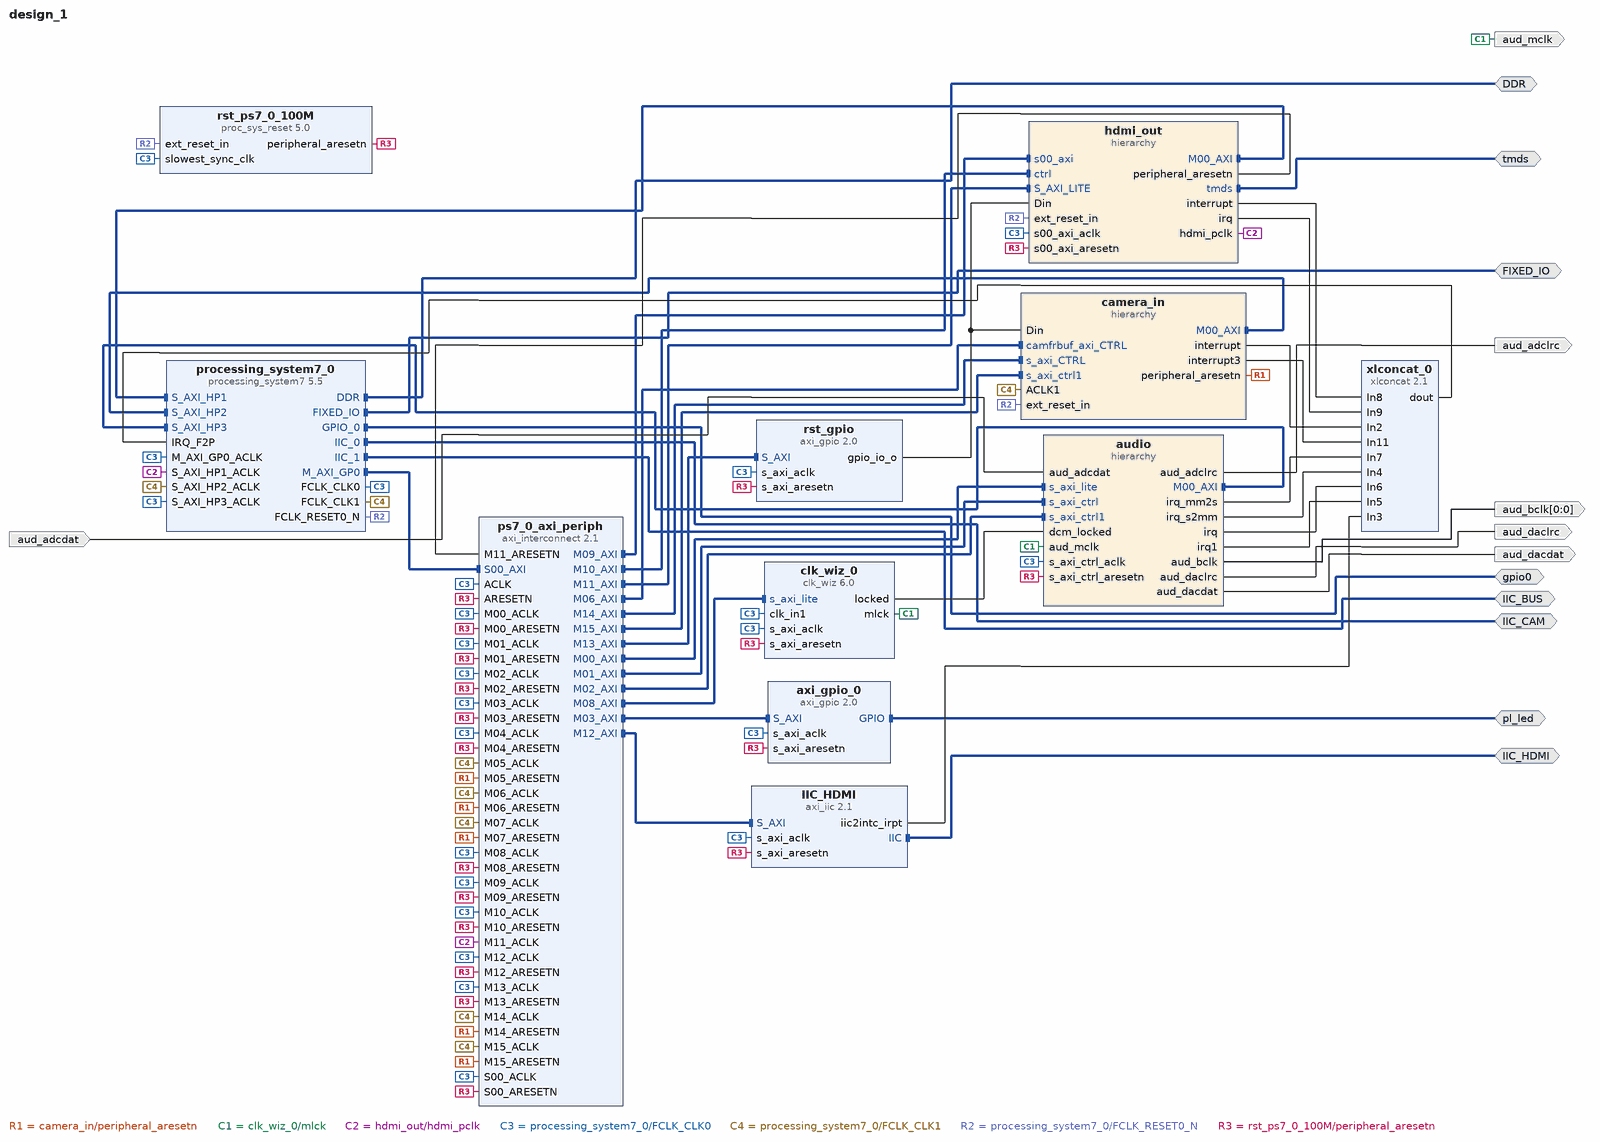
[diagram p0: block diagram of the top level]
# Vivado block design design_1, xc7z020clg400-2, Vivado 2023.1
create_bd_design design_1

create_bd_intf_port -mode Master -vlnv xilinx.com:interface:ddrx_rtl:1.0 DDR
create_bd_intf_port -mode Master -vlnv xilinx.com:display_processing_system7:fixedio_rtl:1.0 FIXED_IO
create_bd_intf_port -mode Master -vlnv xilinx.com:interface:gpio_rtl:1.0 gpio0
create_bd_intf_port -mode Master -vlnv xilinx.com:interface:iic_rtl:1.0 IIC_CAM
create_bd_intf_port -mode Master -vlnv xilinx.com:interface:iic_rtl:1.0 IIC_BUS
create_bd_intf_port -mode Master -vlnv xilinx.com:interface:iic_rtl:1.0 IIC_HDMI
create_bd_intf_port -mode Master -vlnv xilinx.com:interface:gpio_rtl:1.0 pl_led
create_bd_intf_port -mode Master -vlnv openedv.com:user:TMDS_rtl:1.0 tmds
create_bd_port -dir I aud_adcdat
create_bd_port -dir O aud_adclrc
create_bd_port -dir O -from 0 -to 0 aud_bclk
create_bd_port -dir O aud_dacdat
create_bd_port -dir O aud_daclrc
create_bd_port -dir O -type clk aud_mclk

create_bd_cell -type hier audio
create_bd_cell -type hier hdmi_out
create_bd_cell -type hier camera_in
create_bd_cell -type ip -vlnv xilinx.com:ip:axi_iic:2.1 IIC_HDMI
create_bd_cell -type ip -vlnv xilinx.com:ip:axi_gpio:2.0 axi_gpio_0
set_property -dict {CONFIG.C_ALL_OUTPUTS 1 CONFIG.C_GPIO_WIDTH 3} [get_bd_cells axi_gpio_0]
create_bd_cell -type ip -vlnv xilinx.com:ip:clk_wiz:6.0 clk_wiz_0
set_property -dict [list \
  CONFIG.CLKOUT1_DRIVES BUFG \
  CONFIG.CLKOUT1_JITTER 272.870 \
  CONFIG.CLKOUT1_PHASE_ERROR 189.550 \
  CONFIG.CLKOUT1_REQUESTED_OUT_FREQ 16.9344 \
  CONFIG.CLKOUT1_USED true \
  CONFIG.CLKOUT2_DRIVES BUFG \
  CONFIG.CLKOUT2_JITTER 183.032 \
  CONFIG.CLKOUT2_PHASE_ERROR 94.994 \
  CONFIG.CLKOUT2_REQUESTED_OUT_FREQ 100.000 \
  CONFIG.CLKOUT2_USED false \
  CONFIG.CLKOUT3_DRIVES BUFG \
  CONFIG.CLKOUT3_JITTER 145.297 \
  CONFIG.CLKOUT3_PHASE_ERROR 167.636 \
  CONFIG.CLKOUT3_USED false \
  CONFIG.CLKOUT4_DRIVES BUFG \
  CONFIG.CLKOUT5_DRIVES BUFG \
  CONFIG.CLKOUT6_DRIVES BUFG \
  CONFIG.CLKOUT7_DRIVES BUFG \
  CONFIG.CLK_OUT1_PORT mlck \
  CONFIG.CLK_OUT2_PORT clk_out2 \
  CONFIG.MMCM_CLKFBOUT_MULT_F 31.625 \
  CONFIG.MMCM_CLKOUT0_DIVIDE_F 62.250 \
  CONFIG.MMCM_CLKOUT1_DIVIDE 1 \
  CONFIG.MMCM_CLKOUT2_DIVIDE 1 \
  CONFIG.MMCM_DIVCLK_DIVIDE 3 \
  CONFIG.NUM_OUT_CLKS 1 \
  CONFIG.SECONDARY_SOURCE Single_ended_clock_capable_pin \
  CONFIG.USE_DYN_RECONFIG true \
  CONFIG.USE_PHASE_ALIGNMENT false \
] [get_bd_cells clk_wiz_0]
create_bd_cell -type ip -vlnv xilinx.com:ip:processing_system7:5.5 processing_system7_0
set_property -dict [list \
  CONFIG.PCW_APU_PERIPHERAL_FREQMHZ 766.66666666666666666666 \
  CONFIG.PCW_CPU_CPU_6X4X_MAX_RANGE 767 \
  CONFIG.PCW_ENET0_ENET0_IO {MIO 16 .. 27} \
  CONFIG.PCW_ENET0_GRP_MDIO_ENABLE 1 \
  CONFIG.PCW_ENET0_GRP_MDIO_IO {MIO 52 .. 53} \
  CONFIG.PCW_ENET0_PERIPHERAL_ENABLE 1 \
  CONFIG.PCW_ENET0_RESET_ENABLE 1 \
  CONFIG.PCW_ENET0_RESET_IO {MIO 51} \
  CONFIG.PCW_ENET1_PERIPHERAL_CLKSRC External \
  CONFIG.PCW_ENET_RESET_ENABLE 1 \
  CONFIG.PCW_ENET_RESET_SELECT {Share reset pin} \
  CONFIG.PCW_EN_CLK1_PORT 1 \
  CONFIG.PCW_EN_CLK2_PORT 1 \
  CONFIG.PCW_FCLK1_PERIPHERAL_CLKSRC {DDR PLL} \
  CONFIG.PCW_FCLK3_PERIPHERAL_CLKSRC {ARM PLL} \
  CONFIG.PCW_FCLK_CLK1_BUF TRUE \
  CONFIG.PCW_FCLK_CLK2_BUF TRUE \
  CONFIG.PCW_FPGA0_PERIPHERAL_FREQMHZ 100.0 \
  CONFIG.PCW_FPGA1_PERIPHERAL_FREQMHZ 150 \
  CONFIG.PCW_FPGA2_PERIPHERAL_FREQMHZ 200 \
  CONFIG.PCW_FPGA3_PERIPHERAL_FREQMHZ 12 \
  CONFIG.PCW_FPGA_FCLK1_ENABLE 1 \
  CONFIG.PCW_FPGA_FCLK2_ENABLE 1 \
  CONFIG.PCW_GPIO_EMIO_GPIO_ENABLE 1 \
  CONFIG.PCW_GPIO_EMIO_GPIO_IO 10 \
  CONFIG.PCW_GPIO_EMIO_GPIO_WIDTH 10 \
  CONFIG.PCW_GPIO_MIO_GPIO_ENABLE 1 \
  CONFIG.PCW_GPIO_MIO_GPIO_IO MIO \
  CONFIG.PCW_I2C0_I2C0_IO EMIO \
  CONFIG.PCW_I2C0_PERIPHERAL_ENABLE 1 \
  CONFIG.PCW_I2C1_I2C1_IO EMIO \
  CONFIG.PCW_I2C1_PERIPHERAL_ENABLE 1 \
  CONFIG.PCW_I2C_PERIPHERAL_FREQMHZ 127.777779 \
  CONFIG.PCW_I2C_RESET_ENABLE 0 \
  CONFIG.PCW_IRQ_F2P_INTR 1 \
  CONFIG.PCW_PERIPHERAL_BOARD_PRESET None \
  CONFIG.PCW_PRESET_BANK1_VOLTAGE {HSTL 1.8V} \
  CONFIG.PCW_QSPI_GRP_SINGLE_SS_ENABLE 1 \
  CONFIG.PCW_QSPI_GRP_SINGLE_SS_IO {MIO 1 .. 6} \
  CONFIG.PCW_QSPI_PERIPHERAL_ENABLE 1 \
  CONFIG.PCW_QSPI_QSPI_IO {MIO 1 .. 6} \
  CONFIG.PCW_SD0_GRP_CD_ENABLE 0 \
  CONFIG.PCW_SD0_GRP_WP_ENABLE 0 \
  CONFIG.PCW_SD0_PERIPHERAL_ENABLE 1 \
  CONFIG.PCW_SD0_SD0_IO {MIO 40 .. 45} \
  CONFIG.PCW_SD1_PERIPHERAL_ENABLE 1 \
  CONFIG.PCW_SD1_SD1_IO {MIO 10 .. 15} \
  CONFIG.PCW_SDIO_PERIPHERAL_FREQMHZ 125 \
  CONFIG.PCW_SINGLE_QSPI_DATA_MODE x4 \
  CONFIG.PCW_UART1_PERIPHERAL_ENABLE 1 \
  CONFIG.PCW_UART1_UART1_IO {MIO 48 .. 49} \
  CONFIG.PCW_UART_PERIPHERAL_FREQMHZ 100 \
  CONFIG.PCW_UIPARAM_DDR_FREQ_MHZ 533.333333 \
  CONFIG.PCW_UIPARAM_DDR_MEMORY_TYPE {DDR 3 (Low Voltage)} \
  CONFIG.PCW_UIPARAM_DDR_PARTNO {MT41J256M16 RE-125} \
  CONFIG.PCW_USB0_PERIPHERAL_ENABLE 1 \
  CONFIG.PCW_USB0_RESET_ENABLE 1 \
  CONFIG.PCW_USB0_RESET_IO {MIO 46} \
  CONFIG.PCW_USB0_USB0_IO {MIO 28 .. 39} \
  CONFIG.PCW_USB_RESET_ENABLE 1 \
  CONFIG.PCW_USB_RESET_SELECT {Share reset pin} \
  CONFIG.PCW_USE_FABRIC_INTERRUPT 1 \
  CONFIG.PCW_USE_S_AXI_HP1 1 \
  CONFIG.PCW_USE_S_AXI_HP2 1 \
  CONFIG.PCW_USE_S_AXI_HP3 1 \
] [get_bd_cells processing_system7_0]
# 513 more settings of processing_system7_0 are not shown: defaults, MIO pin electricals, DDR timing, and values the tool derives
create_bd_cell -type ip -vlnv xilinx.com:ip:axi_interconnect:2.1 ps7_0_axi_periph
set_property -dict [list \
  CONFIG.M00_HAS_DATA_FIFO 0 \
  CONFIG.M01_HAS_DATA_FIFO 0 \
  CONFIG.M02_HAS_DATA_FIFO 0 \
  CONFIG.M03_HAS_DATA_FIFO 0 \
  CONFIG.NUM_MI 16 \
] [get_bd_cells ps7_0_axi_periph]
create_bd_cell -type ip -vlnv xilinx.com:ip:axi_gpio:2.0 rst_gpio
set_property -dict {CONFIG.C_ALL_OUTPUTS 1 CONFIG.C_GPIO_WIDTH 7} [get_bd_cells rst_gpio]
create_bd_cell -type ip -vlnv xilinx.com:ip:proc_sys_reset:5.0 rst_ps7_0_100M
create_bd_cell -type ip -vlnv xilinx.com:ip:xlconcat:2.1 xlconcat_0
set_property -dict {CONFIG.NUM_PORTS 13 CONFIG.dout_width 13} [get_bd_cells xlconcat_0]

# ---- hierarchy /audio ----
current_bd_instance /audio
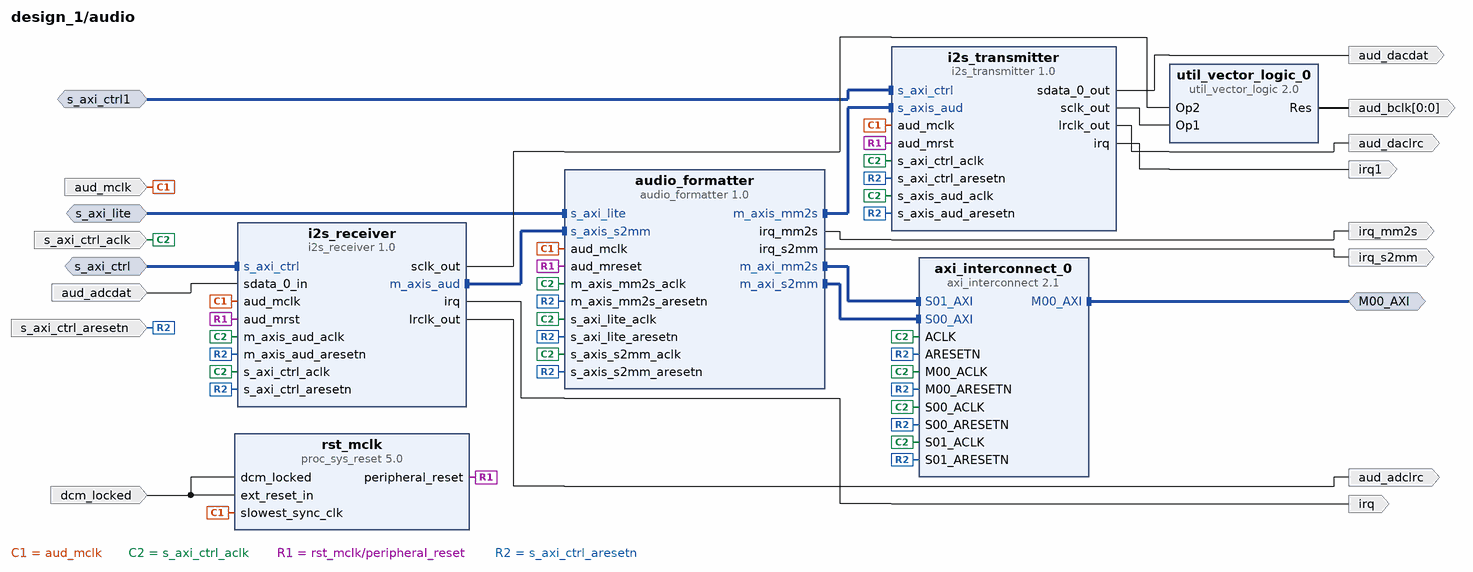
[diagram p1: block diagram inside /audio]
create_bd_intf_pin -mode Master -vlnv xilinx.com:interface:aximm_rtl:1.0 M00_AXI
create_bd_intf_pin -mode Slave -vlnv xilinx.com:interface:aximm_rtl:1.0 s_axi_ctrl
create_bd_intf_pin -mode Slave -vlnv xilinx.com:interface:aximm_rtl:1.0 s_axi_ctrl1
create_bd_intf_pin -mode Slave -vlnv xilinx.com:interface:aximm_rtl:1.0 s_axi_lite
create_bd_pin -dir I aud_adcdat
create_bd_pin -dir O aud_adclrc
create_bd_pin -dir O -from 0 -to 0 aud_bclk
create_bd_pin -dir O aud_dacdat
create_bd_pin -dir O aud_daclrc
create_bd_pin -dir I -type clk aud_mclk
create_bd_pin -dir I dcm_locked
create_bd_pin -dir O -type intr irq
create_bd_pin -dir O -type intr irq1
create_bd_pin -dir O -type intr irq_mm2s
create_bd_pin -dir O -type intr irq_s2mm
create_bd_pin -dir I -type clk s_axi_ctrl_aclk
create_bd_pin -dir I -type rst s_axi_ctrl_aresetn

create_bd_cell -type ip -vlnv xilinx.com:ip:audio_formatter:1.0 audio_formatter
set_property -dict [list \
  CONFIG.C_MM2S_ADDR_WIDTH 32 \
  CONFIG.C_MM2S_ASYNC_CLOCK 0 \
  CONFIG.C_S2MM_ADDR_WIDTH 32 \
  CONFIG.C_S2MM_ASYNC_CLOCK 0 \
] [get_bd_cells audio_formatter]
create_bd_cell -type ip -vlnv xilinx.com:ip:axi_interconnect:2.1 axi_interconnect_0
set_property -dict {CONFIG.NUM_MI 1 CONFIG.NUM_SI 2} [get_bd_cells axi_interconnect_0]
create_bd_cell -type ip -vlnv xilinx.com:ip:i2s_receiver:1.0 i2s_receiver
create_bd_cell -type ip -vlnv xilinx.com:ip:i2s_transmitter:1.0 i2s_transmitter
create_bd_cell -type ip -vlnv xilinx.com:ip:proc_sys_reset:5.0 rst_mclk
create_bd_cell -type ip -vlnv xilinx.com:ip:util_vector_logic:2.0 util_vector_logic_0
set_property -dict {CONFIG.C_OPERATION or CONFIG.C_SIZE 1} [get_bd_cells util_vector_logic_0]

# ---- hierarchy /hdmi_out ----
current_bd_instance /hdmi_out
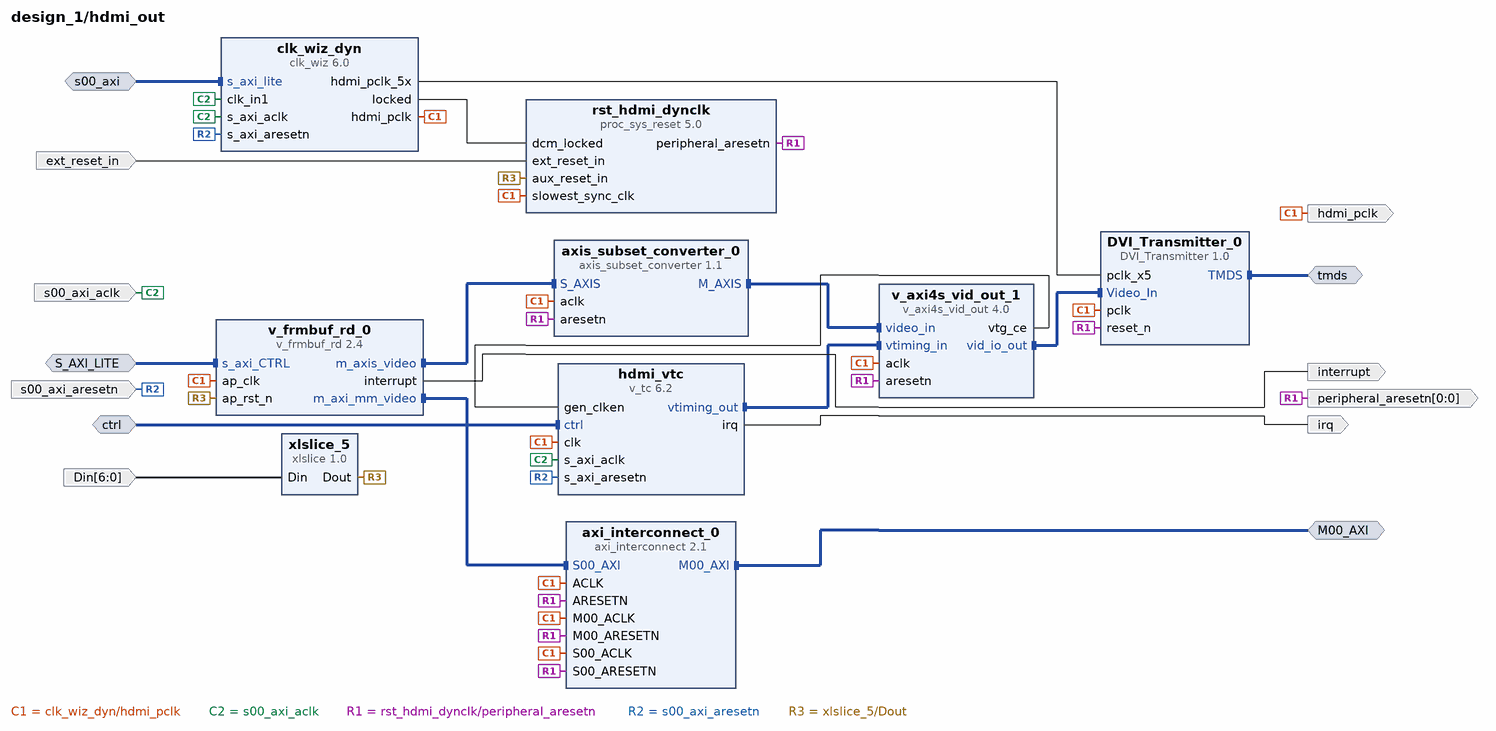
[diagram p2: block diagram inside /hdmi_out]
create_bd_intf_pin -mode Master -vlnv xilinx.com:interface:aximm_rtl:1.0 M00_AXI
create_bd_intf_pin -mode Slave -vlnv xilinx.com:interface:aximm_rtl:1.0 S_AXI_LITE
create_bd_intf_pin -mode Slave -vlnv xilinx.com:interface:aximm_rtl:1.0 ctrl
create_bd_intf_pin -mode Slave -vlnv xilinx.com:interface:aximm_rtl:1.0 s00_axi
create_bd_intf_pin -mode Master -vlnv openedv.com:user:TMDS_rtl:1.0 tmds
create_bd_pin -dir I -from 6 -to 0 Din
create_bd_pin -dir I -type rst ext_reset_in
create_bd_pin -dir O -type clk hdmi_pclk
create_bd_pin -dir O -type intr interrupt
create_bd_pin -dir O -type intr irq
create_bd_pin -dir O -from 0 -to 0 -type rst peripheral_aresetn
create_bd_pin -dir I -type clk s00_axi_aclk
create_bd_pin -dir I -type rst s00_axi_aresetn

create_bd_cell -type ip -vlnv openedv.com:user:DVI_Transmitter:1.0 DVI_Transmitter_0
create_bd_cell -type ip -vlnv xilinx.com:ip:axi_interconnect:2.1 axi_interconnect_0
set_property -dict [list \
  CONFIG.ENABLE_ADVANCED_OPTIONS 0 \
  CONFIG.NUM_MI 1 \
  CONFIG.S00_HAS_DATA_FIFO 2 \
  CONFIG.S00_HAS_REGSLICE 4 \
] [get_bd_cells axi_interconnect_0]
create_bd_cell -type ip -vlnv xilinx.com:ip:axis_subset_converter:1.1 axis_subset_converter_0
set_property -dict [list \
  CONFIG.M_TDATA_NUM_BYTES 3 \
  CONFIG.S_TDATA_NUM_BYTES 3 \
  CONFIG.TDATA_REMAP {tdata[15:8],tdata[7:0],tdata[23:16]} \
  CONFIG.TDEST_REMAP {tdest[0:0]} \
  CONFIG.TID_REMAP {tid[0:0]} \
  CONFIG.TKEEP_REMAP {tkeep[2:0]} \
  CONFIG.TLAST_REMAP {tlast[0]} \
  CONFIG.TSTRB_REMAP {tstrb[2:0]} \
  CONFIG.TUSER_REMAP {tuser[0:0]} \
] [get_bd_cells axis_subset_converter_0]
create_bd_cell -type ip -vlnv xilinx.com:ip:clk_wiz:6.0 clk_wiz_dyn
set_property -dict [list \
  CONFIG.CLKOUT1_DRIVES BUFG \
  CONFIG.CLKOUT1_JITTER 298.245 \
  CONFIG.CLKOUT1_PHASE_ERROR 322.999 \
  CONFIG.CLKOUT1_REQUESTED_OUT_FREQ 148.5 \
  CONFIG.CLKOUT2_DRIVES No_buffer \
  CONFIG.CLKOUT2_JITTER 232.529 \
  CONFIG.CLKOUT2_PHASE_ERROR 322.999 \
  CONFIG.CLKOUT2_REQUESTED_OUT_FREQ 742.5 \
  CONFIG.CLKOUT2_USED true \
  CONFIG.CLKOUT3_DRIVES BUFG \
  CONFIG.CLKOUT4_DRIVES BUFG \
  CONFIG.CLKOUT5_DRIVES BUFG \
  CONFIG.CLKOUT6_DRIVES BUFG \
  CONFIG.CLKOUT7_DRIVES BUFG \
  CONFIG.CLK_OUT1_PORT hdmi_pclk \
  CONFIG.CLK_OUT2_PORT hdmi_pclk_5x \
  CONFIG.FEEDBACK_SOURCE FDBK_AUTO \
  CONFIG.MMCM_BANDWIDTH OPTIMIZED \
  CONFIG.MMCM_CLKFBOUT_MULT_F 37.125 \
  CONFIG.MMCM_CLKOUT0_DIVIDE_F 5.000 \
  CONFIG.MMCM_CLKOUT1_DIVIDE 1 \
  CONFIG.MMCM_COMPENSATION ZHOLD \
  CONFIG.MMCM_DIVCLK_DIVIDE 5 \
  CONFIG.NUM_OUT_CLKS 2 \
  CONFIG.PRIMITIVE MMCM \
  CONFIG.PRIM_SOURCE Single_ended_clock_capable_pin \
  CONFIG.SECONDARY_SOURCE Single_ended_clock_capable_pin \
  CONFIG.USE_DYN_RECONFIG true \
  CONFIG.USE_PHASE_ALIGNMENT false \
] [get_bd_cells clk_wiz_dyn]
create_bd_cell -type ip -vlnv xilinx.com:ip:v_tc:6.2 hdmi_vtc
set_property -dict [list \
  CONFIG.VIDEO_MODE 1080p \
  CONFIG.enable_detection false \
  CONFIG.max_clocks_per_line 4096 \
  CONFIG.max_lines_per_frame 2048 \
] [get_bd_cells hdmi_vtc]
create_bd_cell -type ip -vlnv xilinx.com:ip:proc_sys_reset:5.0 rst_hdmi_dynclk
create_bd_cell -type ip -vlnv xilinx.com:ip:v_axi4s_vid_out:4.0 v_axi4s_vid_out_1
set_property -dict {CONFIG.C_ADDR_WIDTH 11 CONFIG.C_HAS_ASYNC_CLK 0} [get_bd_cells v_axi4s_vid_out_1]
create_bd_cell -type ip -vlnv xilinx.com:ip:v_frmbuf_rd:2.4 v_frmbuf_rd_0
set_property -dict [list \
  CONFIG.AXIMM_DATA_WIDTH 64 \
  CONFIG.C_M_AXI_MM_VIDEO_DATA_WIDTH 64 \
  CONFIG.HAS_BGR8 1 \
  CONFIG.MAX_COLS 1920 \
  CONFIG.MAX_ROWS 1080 \
  CONFIG.SAMPLES_PER_CLOCK 1 \
] [get_bd_cells v_frmbuf_rd_0]
create_bd_cell -type ip -vlnv xilinx.com:ip:xlslice:1.0 xlslice_5
set_property -dict {CONFIG.DIN_FROM 5 CONFIG.DIN_TO 5 CONFIG.DIN_WIDTH 7} [get_bd_cells xlslice_5]

# ---- hierarchy /camera_in ----
current_bd_instance /camera_in
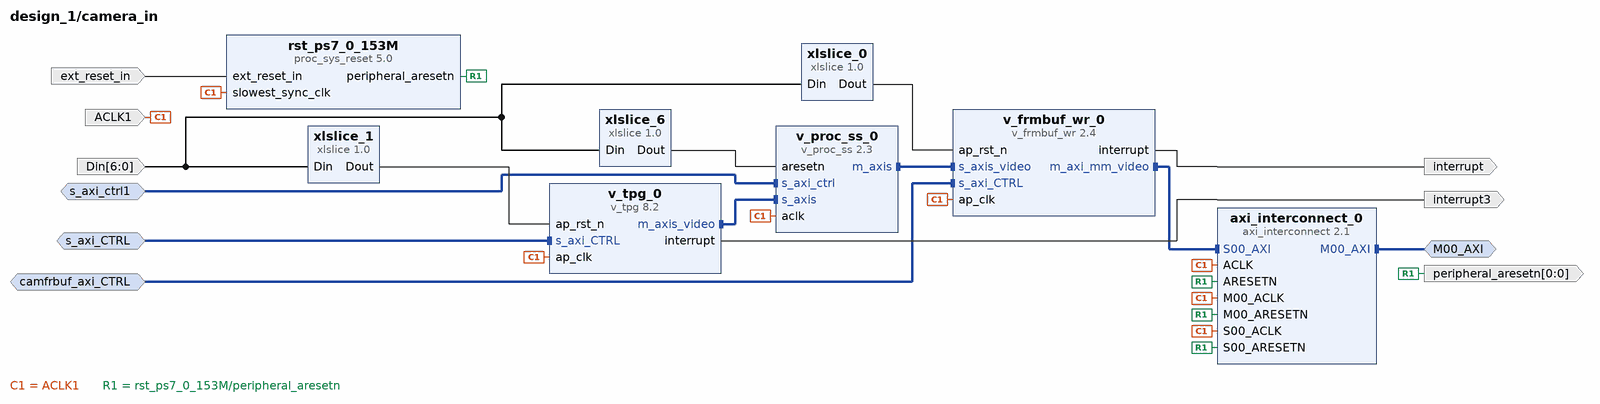
[diagram p3: block diagram inside /camera_in]
create_bd_intf_pin -mode Master -vlnv xilinx.com:interface:aximm_rtl:1.0 M00_AXI
create_bd_intf_pin -mode Slave -vlnv xilinx.com:interface:aximm_rtl:1.0 camfrbuf_axi_CTRL
create_bd_intf_pin -mode Slave -vlnv xilinx.com:interface:aximm_rtl:1.0 s_axi_CTRL
create_bd_intf_pin -mode Slave -vlnv xilinx.com:interface:aximm_rtl:1.0 s_axi_ctrl1
create_bd_pin -dir I -type clk ACLK1
create_bd_pin -dir I -from 6 -to 0 Din
create_bd_pin -dir I -type rst ext_reset_in
create_bd_pin -dir O -type intr interrupt
create_bd_pin -dir O -from 0 -to 0 -type rst peripheral_aresetn
create_bd_pin -dir O -type intr interrupt3

create_bd_cell -type ip -vlnv xilinx.com:ip:axi_interconnect:2.1 axi_interconnect_0
set_property -dict {CONFIG.NUM_MI 1 CONFIG.S00_HAS_DATA_FIFO 2 CONFIG.S00_HAS_REGSLICE 4} [get_bd_cells axi_interconnect_0]
create_bd_cell -type ip -vlnv xilinx.com:ip:proc_sys_reset:5.0 rst_ps7_0_153M
create_bd_cell -type ip -vlnv xilinx.com:ip:v_frmbuf_wr:2.4 v_frmbuf_wr_0
set_property -dict [list \
  CONFIG.AXIMM_DATA_WIDTH 64 \
  CONFIG.C_M_AXI_MM_VIDEO_DATA_WIDTH 64 \
  CONFIG.HAS_BGR8 1 \
  CONFIG.HAS_BGRX8 1 \
  CONFIG.HAS_RGBX8 1 \
  CONFIG.HAS_RGBX10 1 \
  CONFIG.HAS_Y8 1 \
  CONFIG.HAS_Y10 0 \
  CONFIG.HAS_YUV8 1 \
  CONFIG.HAS_YUVX8 1 \
  CONFIG.HAS_YUVX10 1 \
  CONFIG.HAS_YUYV8 1 \
  CONFIG.HAS_Y_UV10 0 \
  CONFIG.HAS_Y_UV8_420 0 \
  CONFIG.HAS_Y_U_V10 0 \
  CONFIG.MAX_COLS 4096 \
  CONFIG.MAX_DATA_WIDTH 10 \
  CONFIG.MAX_NR_PLANES 1 \
  CONFIG.MAX_ROWS 3072 \
  CONFIG.SAMPLES_PER_CLOCK 1 \
] [get_bd_cells v_frmbuf_wr_0]
create_bd_cell -type ip -vlnv xilinx.com:ip:v_proc_ss:2.3 v_proc_ss_0
set_property -dict [list \
  CONFIG.C_COLORSPACE_SUPPORT 0 \
  CONFIG.C_CSC_ENABLE_WINDOW false \
  CONFIG.C_ENABLE_CSC true \
  CONFIG.C_MAX_COLS 4096 \
  CONFIG.C_MAX_DATA_WIDTH 10 \
  CONFIG.C_MAX_ROWS 3072 \
  CONFIG.C_SAMPLES_PER_CLK 1 \
  CONFIG.C_TOPOLOGY 3 \
] [get_bd_cells v_proc_ss_0]
create_bd_cell -type ip -vlnv xilinx.com:ip:xlslice:1.0 xlslice_6
set_property -dict {CONFIG.DIN_FROM 6 CONFIG.DIN_TO 6 CONFIG.DIN_WIDTH 7} [get_bd_cells xlslice_6]
create_bd_cell -type ip -vlnv xilinx.com:ip:xlslice:1.0 xlslice_1
set_property -dict {CONFIG.DIN_FROM 1 CONFIG.DIN_TO 1 CONFIG.DIN_WIDTH 7} [get_bd_cells xlslice_1]
create_bd_cell -type ip -vlnv xilinx.com:ip:v_tpg:8.2 v_tpg_0
set_property -dict {CONFIG.FOREGROUND 1 CONFIG.HAS_AXI4S_SLAVE 0 CONFIG.MAX_DATA_WIDTH 10} [get_bd_cells v_tpg_0]
create_bd_cell -type ip -vlnv xilinx.com:ip:xlslice:1.0 xlslice_0
set_property -dict {CONFIG.DIN_WIDTH 7} [get_bd_cells xlslice_0]

# ---- connections ----

current_bd_instance /audio
connect_bd_intf_net [get_bd_intf_pins M00_AXI] [get_bd_intf_pins axi_interconnect_0/M00_AXI]
connect_bd_intf_net [get_bd_intf_pins audio_formatter/m_axi_mm2s] [get_bd_intf_pins axi_interconnect_0/S01_AXI]
connect_bd_intf_net [get_bd_intf_pins audio_formatter/m_axi_s2mm] [get_bd_intf_pins axi_interconnect_0/S00_AXI]
connect_bd_intf_net [get_bd_intf_pins audio_formatter/m_axis_mm2s] [get_bd_intf_pins i2s_transmitter/s_axis_aud]
connect_bd_intf_net [get_bd_intf_pins audio_formatter/s_axis_s2mm] [get_bd_intf_pins i2s_receiver/m_axis_aud]
connect_bd_intf_net [get_bd_intf_pins s_axi_ctrl] [get_bd_intf_pins i2s_receiver/s_axi_ctrl]
connect_bd_intf_net [get_bd_intf_pins s_axi_lite] [get_bd_intf_pins audio_formatter/s_axi_lite]
connect_bd_intf_net [get_bd_intf_pins s_axi_ctrl1] [get_bd_intf_pins i2s_transmitter/s_axi_ctrl]
connect_bd_net [get_bd_pins audio_formatter/irq_mm2s] [get_bd_pins irq_mm2s]
connect_bd_net [get_bd_pins audio_formatter/irq_s2mm] [get_bd_pins irq_s2mm]
connect_bd_net -net clk_wiz_0_clk_out2 [get_bd_pins aud_mclk] \
  [get_bd_pins audio_formatter/aud_mclk] [get_bd_pins i2s_receiver/aud_mclk] [get_bd_pins i2s_transmitter/aud_mclk] \
  [get_bd_pins rst_mclk/slowest_sync_clk]
connect_bd_net [get_bd_pins dcm_locked] [get_bd_pins rst_mclk/ext_reset_in] [get_bd_pins rst_mclk/dcm_locked]
connect_bd_net [get_bd_pins i2s_receiver/irq] [get_bd_pins irq]
connect_bd_net [get_bd_pins i2s_receiver/lrclk_out] [get_bd_pins aud_adclrc]
connect_bd_net [get_bd_pins i2s_receiver/sclk_out] [get_bd_pins util_vector_logic_0/Op2]
connect_bd_net [get_bd_pins i2s_transmitter/irq] [get_bd_pins irq1]
connect_bd_net [get_bd_pins i2s_transmitter/lrclk_out] [get_bd_pins aud_daclrc]
connect_bd_net [get_bd_pins i2s_transmitter/sclk_out] [get_bd_pins util_vector_logic_0/Op1]
connect_bd_net [get_bd_pins i2s_transmitter/sdata_0_out] [get_bd_pins aud_dacdat]
connect_bd_net -net processing_system7_0_FCLK_CLK0 [get_bd_pins s_axi_ctrl_aclk] \
  [get_bd_pins audio_formatter/s_axi_lite_aclk] [get_bd_pins audio_formatter/m_axis_mm2s_aclk] \
  [get_bd_pins audio_formatter/s_axis_s2mm_aclk] [get_bd_pins axi_interconnect_0/ACLK] \
  [get_bd_pins axi_interconnect_0/S00_ACLK] [get_bd_pins axi_interconnect_0/S01_ACLK] \
  [get_bd_pins axi_interconnect_0/M00_ACLK] [get_bd_pins i2s_receiver/s_axi_ctrl_aclk] \
  [get_bd_pins i2s_receiver/m_axis_aud_aclk] [get_bd_pins i2s_transmitter/s_axi_ctrl_aclk] \
  [get_bd_pins i2s_transmitter/s_axis_aud_aclk]
connect_bd_net -net rst_clk_wiz_0_16M_peripheral_reset [get_bd_pins rst_mclk/peripheral_reset] \
  [get_bd_pins audio_formatter/aud_mreset] [get_bd_pins i2s_receiver/aud_mrst] [get_bd_pins i2s_transmitter/aud_mrst]
connect_bd_net -net rst_ps7_0_100M_peripheral_aresetn [get_bd_pins s_axi_ctrl_aresetn] \
  [get_bd_pins audio_formatter/s_axi_lite_aresetn] [get_bd_pins audio_formatter/m_axis_mm2s_aresetn] \
  [get_bd_pins audio_formatter/s_axis_s2mm_aresetn] [get_bd_pins axi_interconnect_0/ARESETN] \
  [get_bd_pins axi_interconnect_0/S00_ARESETN] [get_bd_pins axi_interconnect_0/S01_ARESETN] \
  [get_bd_pins axi_interconnect_0/M00_ARESETN] [get_bd_pins i2s_receiver/s_axi_ctrl_aresetn] \
  [get_bd_pins i2s_receiver/m_axis_aud_aresetn] [get_bd_pins i2s_transmitter/s_axi_ctrl_aresetn] \
  [get_bd_pins i2s_transmitter/s_axis_aud_aresetn]
connect_bd_net -net sdata_0_in_0_1 [get_bd_pins aud_adcdat] [get_bd_pins i2s_receiver/sdata_0_in]
connect_bd_net [get_bd_pins util_vector_logic_0/Res] [get_bd_pins aud_bclk]

current_bd_instance /hdmi_out
connect_bd_intf_net [get_bd_intf_pins M00_AXI] [get_bd_intf_pins axi_interconnect_0/M00_AXI]
connect_bd_intf_net [get_bd_intf_pins tmds] [get_bd_intf_pins DVI_Transmitter_0/TMDS]
connect_bd_intf_net [get_bd_intf_pins S_AXI_LITE] [get_bd_intf_pins v_frmbuf_rd_0/s_axi_CTRL]
connect_bd_intf_net [get_bd_intf_pins axis_subset_converter_0/M_AXIS] [get_bd_intf_pins v_axi4s_vid_out_1/video_in]
connect_bd_intf_net [get_bd_intf_pins hdmi_vtc/vtiming_out] [get_bd_intf_pins v_axi4s_vid_out_1/vtiming_in]
connect_bd_intf_net [get_bd_intf_pins ctrl] [get_bd_intf_pins hdmi_vtc/ctrl]
connect_bd_intf_net [get_bd_intf_pins s00_axi] [get_bd_intf_pins clk_wiz_dyn/s_axi_lite]
connect_bd_intf_net [get_bd_intf_pins DVI_Transmitter_0/Video_In] [get_bd_intf_pins v_axi4s_vid_out_1/vid_io_out]
connect_bd_intf_net [get_bd_intf_pins axi_interconnect_0/S00_AXI] [get_bd_intf_pins v_frmbuf_rd_0/m_axi_mm_video]
connect_bd_intf_net [get_bd_intf_pins axis_subset_converter_0/S_AXIS] [get_bd_intf_pins v_frmbuf_rd_0/m_axis_video]
connect_bd_net [get_bd_pins Din] [get_bd_pins xlslice_5/Din]
connect_bd_net -net clk_wiz_0_hdmi_pclk_5x [get_bd_pins clk_wiz_dyn/hdmi_pclk_5x] [get_bd_pins DVI_Transmitter_0/pclk_x5]
connect_bd_net -net clk_wiz_0_locked [get_bd_pins clk_wiz_dyn/locked] [get_bd_pins rst_hdmi_dynclk/dcm_locked]
connect_bd_net [get_bd_pins ext_reset_in] [get_bd_pins rst_hdmi_dynclk/ext_reset_in]
connect_bd_net -net hdmi_dynclk_PXL_CLK_O [get_bd_pins clk_wiz_dyn/hdmi_pclk] \
  [get_bd_pins hdmi_pclk] [get_bd_pins DVI_Transmitter_0/pclk] [get_bd_pins axi_interconnect_0/ACLK] \
  [get_bd_pins axi_interconnect_0/S00_ACLK] [get_bd_pins axi_interconnect_0/M00_ACLK] \
  [get_bd_pins axis_subset_converter_0/aclk] [get_bd_pins hdmi_vtc/clk] [get_bd_pins rst_hdmi_dynclk/slowest_sync_clk] \
  [get_bd_pins v_axi4s_vid_out_1/aclk] [get_bd_pins v_frmbuf_rd_0/ap_clk]
connect_bd_net [get_bd_pins hdmi_vtc/irq] [get_bd_pins irq]
connect_bd_net -net processing_system7_0_FCLK_CLK0 [get_bd_pins s00_axi_aclk] \
  [get_bd_pins clk_wiz_dyn/s_axi_aclk] [get_bd_pins clk_wiz_dyn/clk_in1] [get_bd_pins hdmi_vtc/s_axi_aclk]
connect_bd_net -net rst_hdmi_dynclk_100M_peripheral_aresetn [get_bd_pins rst_hdmi_dynclk/peripheral_aresetn] \
  [get_bd_pins peripheral_aresetn] [get_bd_pins DVI_Transmitter_0/reset_n] [get_bd_pins axi_interconnect_0/ARESETN] \
  [get_bd_pins axi_interconnect_0/S00_ARESETN] [get_bd_pins axi_interconnect_0/M00_ARESETN] \
  [get_bd_pins axis_subset_converter_0/aresetn] [get_bd_pins v_axi4s_vid_out_1/aresetn]
connect_bd_net -net rst_ps7_0_100M_peripheral_aresetn [get_bd_pins s00_axi_aresetn] \
  [get_bd_pins clk_wiz_dyn/s_axi_aresetn] [get_bd_pins hdmi_vtc/s_axi_aresetn]
connect_bd_net [get_bd_pins v_axi4s_vid_out_1/vtg_ce] [get_bd_pins hdmi_vtc/gen_clken]
connect_bd_net [get_bd_pins v_frmbuf_rd_0/interrupt] [get_bd_pins interrupt]
connect_bd_net -net xlslice_0_Dout [get_bd_pins xlslice_5/Dout] [get_bd_pins v_frmbuf_rd_0/ap_rst_n] [get_bd_pins rst_hdmi_dynclk/aux_reset_in]

current_bd_instance /camera_in
connect_bd_intf_net [get_bd_intf_pins M00_AXI] [get_bd_intf_pins axi_interconnect_0/M00_AXI]
connect_bd_intf_net [get_bd_intf_pins v_proc_ss_0/s_axi_ctrl] [get_bd_intf_pins s_axi_ctrl1]
connect_bd_intf_net [get_bd_intf_pins camfrbuf_axi_CTRL] [get_bd_intf_pins v_frmbuf_wr_0/s_axi_CTRL]
connect_bd_intf_net [get_bd_intf_pins s_axi_CTRL] [get_bd_intf_pins v_tpg_0/s_axi_CTRL]
connect_bd_intf_net [get_bd_intf_pins axi_interconnect_0/S00_AXI] [get_bd_intf_pins v_frmbuf_wr_0/m_axi_mm_video]
connect_bd_intf_net [get_bd_intf_pins v_proc_ss_0/m_axis] [get_bd_intf_pins v_frmbuf_wr_0/s_axis_video]
connect_bd_intf_net [get_bd_intf_pins v_tpg_0/m_axis_video] [get_bd_intf_pins v_proc_ss_0/s_axis]
connect_bd_net [get_bd_pins ACLK1] \
  [get_bd_pins axi_interconnect_0/ACLK] [get_bd_pins axi_interconnect_0/S00_ACLK] [get_bd_pins axi_interconnect_0/M00_ACLK] \
  [get_bd_pins rst_ps7_0_153M/slowest_sync_clk] [get_bd_pins v_frmbuf_wr_0/ap_clk] [get_bd_pins v_proc_ss_0/aclk] \
  [get_bd_pins v_tpg_0/ap_clk]
connect_bd_net [get_bd_pins Din] [get_bd_pins xlslice_6/Din] [get_bd_pins xlslice_1/Din] [get_bd_pins xlslice_0/Din]
connect_bd_net [get_bd_pins ext_reset_in] [get_bd_pins rst_ps7_0_153M/ext_reset_in]
connect_bd_net [get_bd_pins rst_ps7_0_153M/peripheral_aresetn] \
  [get_bd_pins peripheral_aresetn] [get_bd_pins axi_interconnect_0/ARESETN] [get_bd_pins axi_interconnect_0/S00_ARESETN] \
  [get_bd_pins axi_interconnect_0/M00_ARESETN]
connect_bd_net [get_bd_pins v_frmbuf_wr_0/interrupt] [get_bd_pins interrupt]
connect_bd_net [get_bd_pins v_tpg_0/interrupt] [get_bd_pins interrupt3]
connect_bd_net [get_bd_pins xlslice_0/Dout] [get_bd_pins v_frmbuf_wr_0/ap_rst_n]
connect_bd_net [get_bd_pins xlslice_1/Dout] [get_bd_pins v_tpg_0/ap_rst_n]
connect_bd_net [get_bd_pins xlslice_6/Dout] [get_bd_pins v_proc_ss_0/aresetn]

current_bd_instance /
connect_bd_intf_net -intf_net DVI_Transmitter_0_TMDS [get_bd_intf_ports tmds] [get_bd_intf_pins hdmi_out/tmds]
connect_bd_intf_net [get_bd_intf_pins audio/M00_AXI] [get_bd_intf_pins processing_system7_0/S_AXI_HP3]
connect_bd_intf_net [get_bd_intf_ports pl_led] [get_bd_intf_pins axi_gpio_0/GPIO]
connect_bd_intf_net [get_bd_intf_pins camera_in/M00_AXI] [get_bd_intf_pins processing_system7_0/S_AXI_HP2]
connect_bd_intf_net [get_bd_intf_pins hdmi_out/M00_AXI] [get_bd_intf_pins processing_system7_0/S_AXI_HP1]
connect_bd_intf_net -intf_net i2c2_IIC [get_bd_intf_ports IIC_HDMI] [get_bd_intf_pins IIC_HDMI/IIC]
connect_bd_intf_net [get_bd_intf_ports DDR] [get_bd_intf_pins processing_system7_0/DDR]
connect_bd_intf_net [get_bd_intf_ports FIXED_IO] [get_bd_intf_pins processing_system7_0/FIXED_IO]
connect_bd_intf_net [get_bd_intf_ports gpio0] [get_bd_intf_pins processing_system7_0/GPIO_0]
connect_bd_intf_net [get_bd_intf_ports IIC_CAM] [get_bd_intf_pins processing_system7_0/IIC_0]
connect_bd_intf_net [get_bd_intf_ports IIC_BUS] [get_bd_intf_pins processing_system7_0/IIC_1]
connect_bd_intf_net [get_bd_intf_pins processing_system7_0/M_AXI_GP0] [get_bd_intf_pins ps7_0_axi_periph/S00_AXI]
connect_bd_intf_net [get_bd_intf_pins ps7_0_axi_periph/M00_AXI] [get_bd_intf_pins audio/s_axi_lite]
connect_bd_intf_net [get_bd_intf_pins ps7_0_axi_periph/M01_AXI] [get_bd_intf_pins audio/s_axi_ctrl]
connect_bd_intf_net [get_bd_intf_pins ps7_0_axi_periph/M02_AXI] [get_bd_intf_pins audio/s_axi_ctrl1]
connect_bd_intf_net [get_bd_intf_pins ps7_0_axi_periph/M03_AXI] [get_bd_intf_pins axi_gpio_0/S_AXI]
connect_bd_intf_net [get_bd_intf_pins ps7_0_axi_periph/M06_AXI] [get_bd_intf_pins camera_in/camfrbuf_axi_CTRL]
connect_bd_intf_net [get_bd_intf_pins ps7_0_axi_periph/M08_AXI] [get_bd_intf_pins clk_wiz_0/s_axi_lite]
connect_bd_intf_net [get_bd_intf_pins ps7_0_axi_periph/M09_AXI] [get_bd_intf_pins hdmi_out/s00_axi]
connect_bd_intf_net [get_bd_intf_pins ps7_0_axi_periph/M10_AXI] [get_bd_intf_pins hdmi_out/ctrl]
connect_bd_intf_net [get_bd_intf_pins ps7_0_axi_periph/M11_AXI] [get_bd_intf_pins hdmi_out/S_AXI_LITE]
connect_bd_intf_net [get_bd_intf_pins ps7_0_axi_periph/M12_AXI] [get_bd_intf_pins IIC_HDMI/S_AXI]
connect_bd_intf_net [get_bd_intf_pins ps7_0_axi_periph/M13_AXI] [get_bd_intf_pins rst_gpio/S_AXI]
connect_bd_intf_net [get_bd_intf_pins ps7_0_axi_periph/M14_AXI] [get_bd_intf_pins camera_in/s_axi_CTRL]
connect_bd_intf_net [get_bd_intf_pins ps7_0_axi_periph/M15_AXI] [get_bd_intf_pins camera_in/s_axi_ctrl1]
connect_bd_net -net audio_formatter_irq_mm2s [get_bd_pins audio/irq_mm2s] [get_bd_pins xlconcat_0/In7]
connect_bd_net -net audio_formatter_irq_s2mm [get_bd_pins audio/irq_s2mm] [get_bd_pins xlconcat_0/In4]
connect_bd_net [get_bd_pins camera_in/interrupt] [get_bd_pins xlconcat_0/In2]
connect_bd_net [get_bd_pins camera_in/interrupt3] [get_bd_pins xlconcat_0/In11]
connect_bd_net [get_bd_pins camera_in/peripheral_aresetn] \
  [get_bd_pins ps7_0_axi_periph/M05_ARESETN] [get_bd_pins ps7_0_axi_periph/M06_ARESETN] \
  [get_bd_pins ps7_0_axi_periph/M07_ARESETN] [get_bd_pins ps7_0_axi_periph/M14_ARESETN] \
  [get_bd_pins ps7_0_axi_periph/M15_ARESETN]
connect_bd_net [get_bd_pins clk_wiz_0/locked] [get_bd_pins audio/dcm_locked]
connect_bd_net -net clk_wiz_0_mclk [get_bd_pins clk_wiz_0/mlck] [get_bd_pins audio/aud_mclk] [get_bd_ports aud_mclk]
connect_bd_net [get_bd_pins hdmi_out/hdmi_pclk] [get_bd_pins processing_system7_0/S_AXI_HP1_ACLK] [get_bd_pins ps7_0_axi_periph/M11_ACLK]
connect_bd_net [get_bd_pins hdmi_out/interrupt] [get_bd_pins xlconcat_0/In8]
connect_bd_net [get_bd_pins hdmi_out/irq] [get_bd_pins xlconcat_0/In9]
connect_bd_net [get_bd_pins hdmi_out/peripheral_aresetn] [get_bd_pins ps7_0_axi_periph/M11_ARESETN]
connect_bd_net -net i2c2_iic2intc_irpt [get_bd_pins IIC_HDMI/iic2intc_irpt] [get_bd_pins xlconcat_0/In3]
connect_bd_net -net i2s_receiver_irq [get_bd_pins audio/irq] [get_bd_pins xlconcat_0/In6]
connect_bd_net -net i2s_receiver_lrclk_out [get_bd_pins audio/aud_adclrc] [get_bd_ports aud_adclrc]
connect_bd_net -net i2s_transmitter_irq [get_bd_pins audio/irq1] [get_bd_pins xlconcat_0/In5]
connect_bd_net -net i2s_transmitter_lrclk_out [get_bd_pins audio/aud_daclrc] [get_bd_ports aud_daclrc]
connect_bd_net -net i2s_transmitter_sclk_out [get_bd_pins audio/aud_bclk] [get_bd_ports aud_bclk]
connect_bd_net -net i2s_transmitter_sdata_0_out [get_bd_pins audio/aud_dacdat] [get_bd_ports aud_dacdat]
connect_bd_net [get_bd_pins processing_system7_0/FCLK_CLK0] \
  [get_bd_pins audio/s_axi_ctrl_aclk] [get_bd_pins hdmi_out/s00_axi_aclk] [get_bd_pins IIC_HDMI/s_axi_aclk] \
  [get_bd_pins axi_gpio_0/s_axi_aclk] [get_bd_pins clk_wiz_0/s_axi_aclk] [get_bd_pins clk_wiz_0/clk_in1] \
  [get_bd_pins processing_system7_0/M_AXI_GP0_ACLK] [get_bd_pins processing_system7_0/S_AXI_HP3_ACLK] \
  [get_bd_pins ps7_0_axi_periph/ACLK] [get_bd_pins ps7_0_axi_periph/S00_ACLK] [get_bd_pins ps7_0_axi_periph/M00_ACLK] \
  [get_bd_pins ps7_0_axi_periph/M01_ACLK] [get_bd_pins ps7_0_axi_periph/M02_ACLK] [get_bd_pins ps7_0_axi_periph/M03_ACLK] \
  [get_bd_pins ps7_0_axi_periph/M04_ACLK] [get_bd_pins ps7_0_axi_periph/M08_ACLK] [get_bd_pins ps7_0_axi_periph/M09_ACLK] \
  [get_bd_pins ps7_0_axi_periph/M10_ACLK] [get_bd_pins ps7_0_axi_periph/M12_ACLK] [get_bd_pins ps7_0_axi_periph/M13_ACLK] \
  [get_bd_pins rst_gpio/s_axi_aclk] [get_bd_pins rst_ps7_0_100M/slowest_sync_clk]
connect_bd_net [get_bd_pins processing_system7_0/FCLK_CLK1] \
  [get_bd_pins camera_in/ACLK1] [get_bd_pins processing_system7_0/S_AXI_HP2_ACLK] [get_bd_pins ps7_0_axi_periph/M05_ACLK] \
  [get_bd_pins ps7_0_axi_periph/M06_ACLK] [get_bd_pins ps7_0_axi_periph/M07_ACLK] [get_bd_pins ps7_0_axi_periph/M14_ACLK] \
  [get_bd_pins ps7_0_axi_periph/M15_ACLK]
connect_bd_net [get_bd_pins processing_system7_0/FCLK_RESET0_N] \
  [get_bd_pins hdmi_out/ext_reset_in] [get_bd_pins camera_in/ext_reset_in] [get_bd_pins rst_ps7_0_100M/ext_reset_in]
connect_bd_net -net rest_gpio_gpio_io_o [get_bd_pins rst_gpio/gpio_io_o] [get_bd_pins hdmi_out/Din] [get_bd_pins camera_in/Din]
connect_bd_net [get_bd_pins rst_ps7_0_100M/peripheral_aresetn] \
  [get_bd_pins audio/s_axi_ctrl_aresetn] [get_bd_pins hdmi_out/s00_axi_aresetn] [get_bd_pins IIC_HDMI/s_axi_aresetn] \
  [get_bd_pins axi_gpio_0/s_axi_aresetn] [get_bd_pins clk_wiz_0/s_axi_aresetn] [get_bd_pins ps7_0_axi_periph/ARESETN] \
  [get_bd_pins ps7_0_axi_periph/S00_ARESETN] [get_bd_pins ps7_0_axi_periph/M00_ARESETN] \
  [get_bd_pins ps7_0_axi_periph/M01_ARESETN] [get_bd_pins ps7_0_axi_periph/M02_ARESETN] \
  [get_bd_pins ps7_0_axi_periph/M03_ARESETN] [get_bd_pins ps7_0_axi_periph/M04_ARESETN] \
  [get_bd_pins ps7_0_axi_periph/M08_ARESETN] [get_bd_pins ps7_0_axi_periph/M09_ARESETN] \
  [get_bd_pins ps7_0_axi_periph/M10_ARESETN] [get_bd_pins ps7_0_axi_periph/M12_ARESETN] \
  [get_bd_pins ps7_0_axi_periph/M13_ARESETN] [get_bd_pins rst_gpio/s_axi_aresetn]
connect_bd_net -net sdata_0_in_0_1 [get_bd_ports aud_adcdat] [get_bd_pins audio/aud_adcdat]
connect_bd_net [get_bd_pins xlconcat_0/dout] [get_bd_pins processing_system7_0/IRQ_F2P]

# ---- address map ----
assign_bd_address -offset 0x00000000 -range 1G -target_address_space [get_bd_addr_spaces audio/audio_formatter/m_axi_mm2s] [get_bd_addr_segs processing_system7_0/S_AXI_HP3/HP3_DDR_LOWOCM]
assign_bd_address -offset 0x00000000 -range 1G -target_address_space [get_bd_addr_spaces audio/audio_formatter/m_axi_s2mm] [get_bd_addr_segs processing_system7_0/S_AXI_HP3/HP3_DDR_LOWOCM]
assign_bd_address -offset 0x00000000 -range 1G -target_address_space [get_bd_addr_spaces camera_in/v_frmbuf_wr_0/Data_m_axi_mm_video] [get_bd_addr_segs processing_system7_0/S_AXI_HP2/HP2_DDR_LOWOCM]
assign_bd_address -offset 0x00000000 -range 1G -target_address_space [get_bd_addr_spaces hdmi_out/v_frmbuf_rd_0/Data_m_axi_mm_video] [get_bd_addr_segs processing_system7_0/S_AXI_HP1/HP1_DDR_LOWOCM]
assign_bd_address -offset 0x41210000 -range 64K -target_address_space [get_bd_addr_spaces processing_system7_0/Data] [get_bd_addr_segs axi_gpio_0/S_AXI/Reg]
assign_bd_address -offset 0x41220000 -range 64K -target_address_space [get_bd_addr_spaces processing_system7_0/Data] [get_bd_addr_segs rst_gpio/S_AXI/Reg]
assign_bd_address -offset 0x41600000 -range 64K -target_address_space [get_bd_addr_spaces processing_system7_0/Data] [get_bd_addr_segs IIC_HDMI/S_AXI/Reg]
assign_bd_address -offset 0x43C20000 -range 64K -target_address_space [get_bd_addr_spaces processing_system7_0/Data] [get_bd_addr_segs camera_in/v_tpg_0/s_axi_CTRL/Reg]
assign_bd_address -offset 0x43C30000 -range 64K -target_address_space [get_bd_addr_spaces processing_system7_0/Data] [get_bd_addr_segs clk_wiz_0/s_axi_lite/Reg]
assign_bd_address -offset 0x43C40000 -range 64K -target_address_space [get_bd_addr_spaces processing_system7_0/Data] [get_bd_addr_segs camera_in/v_frmbuf_wr_0/s_axi_CTRL/Reg]
assign_bd_address -offset 0x43C50000 -range 64K -target_address_space [get_bd_addr_spaces processing_system7_0/Data] [get_bd_addr_segs audio/audio_formatter/s_axi_lite/reg0]
assign_bd_address -offset 0x43C60000 -range 64K -target_address_space [get_bd_addr_spaces processing_system7_0/Data] [get_bd_addr_segs audio/i2s_receiver/s_axi_ctrl/Reg]
assign_bd_address -offset 0x43C70000 -range 64K -target_address_space [get_bd_addr_spaces processing_system7_0/Data] [get_bd_addr_segs audio/i2s_transmitter/s_axi_ctrl/Reg]
assign_bd_address -offset 0x43C80000 -range 64K -target_address_space [get_bd_addr_spaces processing_system7_0/Data] [get_bd_addr_segs hdmi_out/clk_wiz_dyn/s_axi_lite/Reg]
assign_bd_address -offset 0x43C90000 -range 64K -target_address_space [get_bd_addr_spaces processing_system7_0/Data] [get_bd_addr_segs hdmi_out/hdmi_vtc/ctrl/Reg]
assign_bd_address -offset 0x43CA0000 -range 64K -target_address_space [get_bd_addr_spaces processing_system7_0/Data] [get_bd_addr_segs hdmi_out/v_frmbuf_rd_0/s_axi_CTRL/Reg]
assign_bd_address -offset 0x43CC0000 -range 64K -target_address_space [get_bd_addr_spaces processing_system7_0/Data] [get_bd_addr_segs camera_in/v_proc_ss_0/s_axi_ctrl/Reg]

validate_bd_design
save_bd_design
